# Altium schematic sheet РЕУН.468172.001_Connectors.SchDoc: =Name-1str
size 420 x 297 mm; SheetNumber: 5; Вид изделия: Документация; Раздел: Документация; Код документа: Э3; Вид документа: Схема электрическая принципиальная; Класс документа: Конструкторский документ; Создавать изделие в PLM: Yes; DocumentCode: РЕУН.468172.001 Э3 2D; DocumentView: Схема электрическая принципиальная; DocumentClass: Конструкторский документ; ProductView: Документация; Format: А3
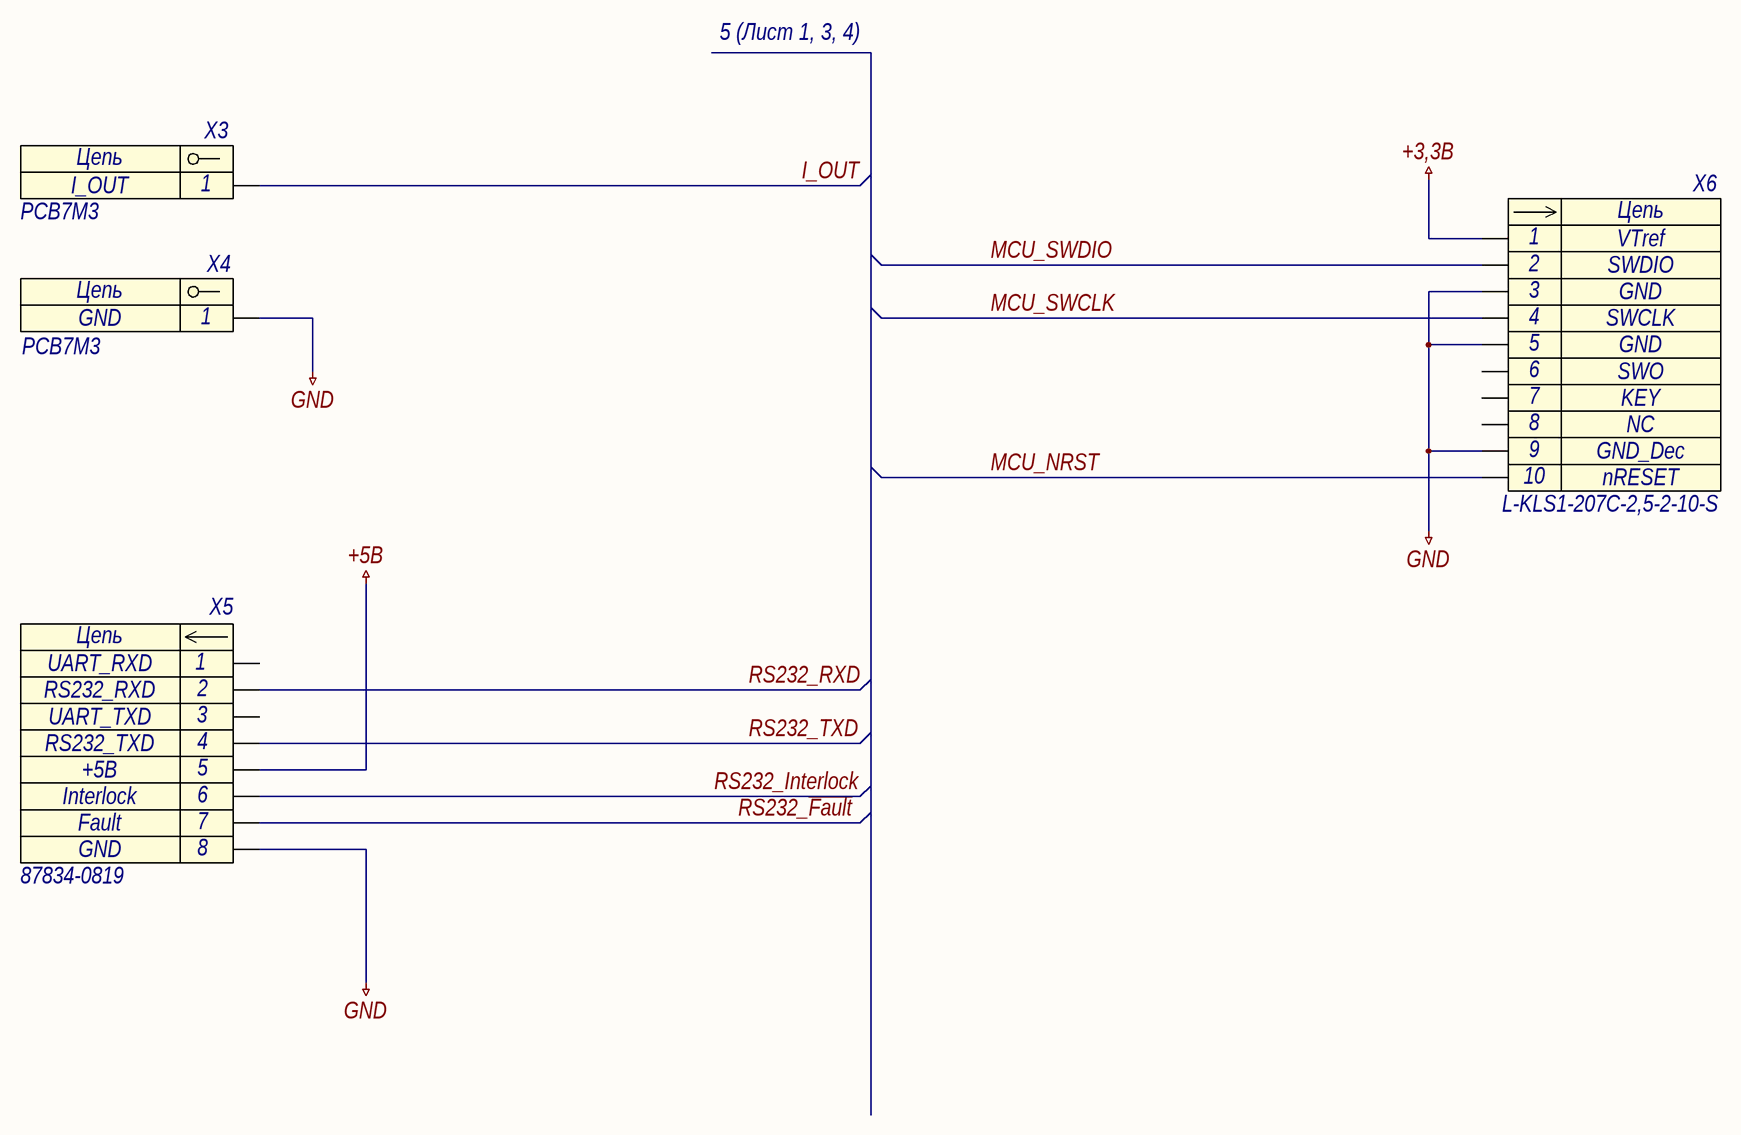
[diagram p0: РЕУН.468172.001_Connectors.SchDoc]

## Parts
X3  PCB7M3
X4  PCB7M3
X5  87834-0819
X6  L-KLS1-207C-2,5-2-10-S

## Nets
+3,3В: X6.1
+5В: X5.5
GND: X4.1 X5.8 X6.3 X6.5 X6.9
I_OUT: X3.1
MCU_NRST: X6.10
MCU_SWCLK: X6.4
MCU_SWDIO: X6.2
RS232_~{Fault}: X5.7
RS232_Interlock: X5.6
RS232_RXD: X5.2
RS232_TXD: X5.4

Not connected (* = marked no-connect by the designer): X5 1 3; X6 6 7 8

## Notes on the sheet
- 5 (Лист 1, 3, 4)
- Подп. и дата
- Инв. № дубл.
- Взам. инв. №
- Инв. № подл.
- Лист
- Изм.
- № докум.
- Подп.
- Дата
- Копировал
- Формат
- (in symbol x1-k) Цепь
- (in symbol x8-m) Цепь
- (in symbol x10-m) Цепь

## Library data of the parts
X3 = x1-k: Разъем - 1 конт. клемма; Contact_1: I_OUT; Name: PCB7M3
X4 = x1-k: Разъем - 1 конт. клемма; Contact_1: GND; Name: PCB7M3
X5 = x8-m: Разъем - 8 конт. вилка; Contact_1: UART_RXD; Contact_2: RS232_RXD; Contact_3: UART_TXD; Contact_4: RS232_TXD; Contact_5: +5В; Contact_6: Interlock; Contact_7: Fault; Contact_8: GND; Name: 87834-0819
X6 = x10-m: Разъем - 10 конт. вилка; Contact_1: VTref; Contact_2: SWDIO; Contact_3: GND; Contact_4: SWCLK; Contact_6: SWO; Contact_7: KEY; Contact_8: NC; Contact_9: GND_Dec; Contact_10: nRESET; Contact_5: GND; Name: L-KLS1-207C-2,5-2-10-S